# Altium schematic sheet A2_SH1(No_Logo).SchDoc
size A2; SheetNumber: 2; SheetTotal: 6
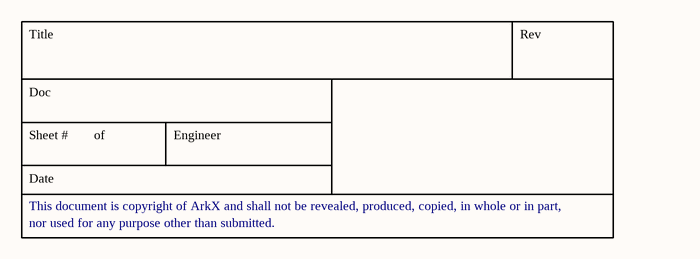
[diagram p0: A2_SH1(No_Logo).SchDoc]

## Notes on the sheet
- Title
- Rev
- Doc
- Sheet #
- of
- Engineer
- This document is copyright of ArkX and shall not be revealed, produced, copied, in whole or in part,
- Date
- nor used for any purpose other than submitted.